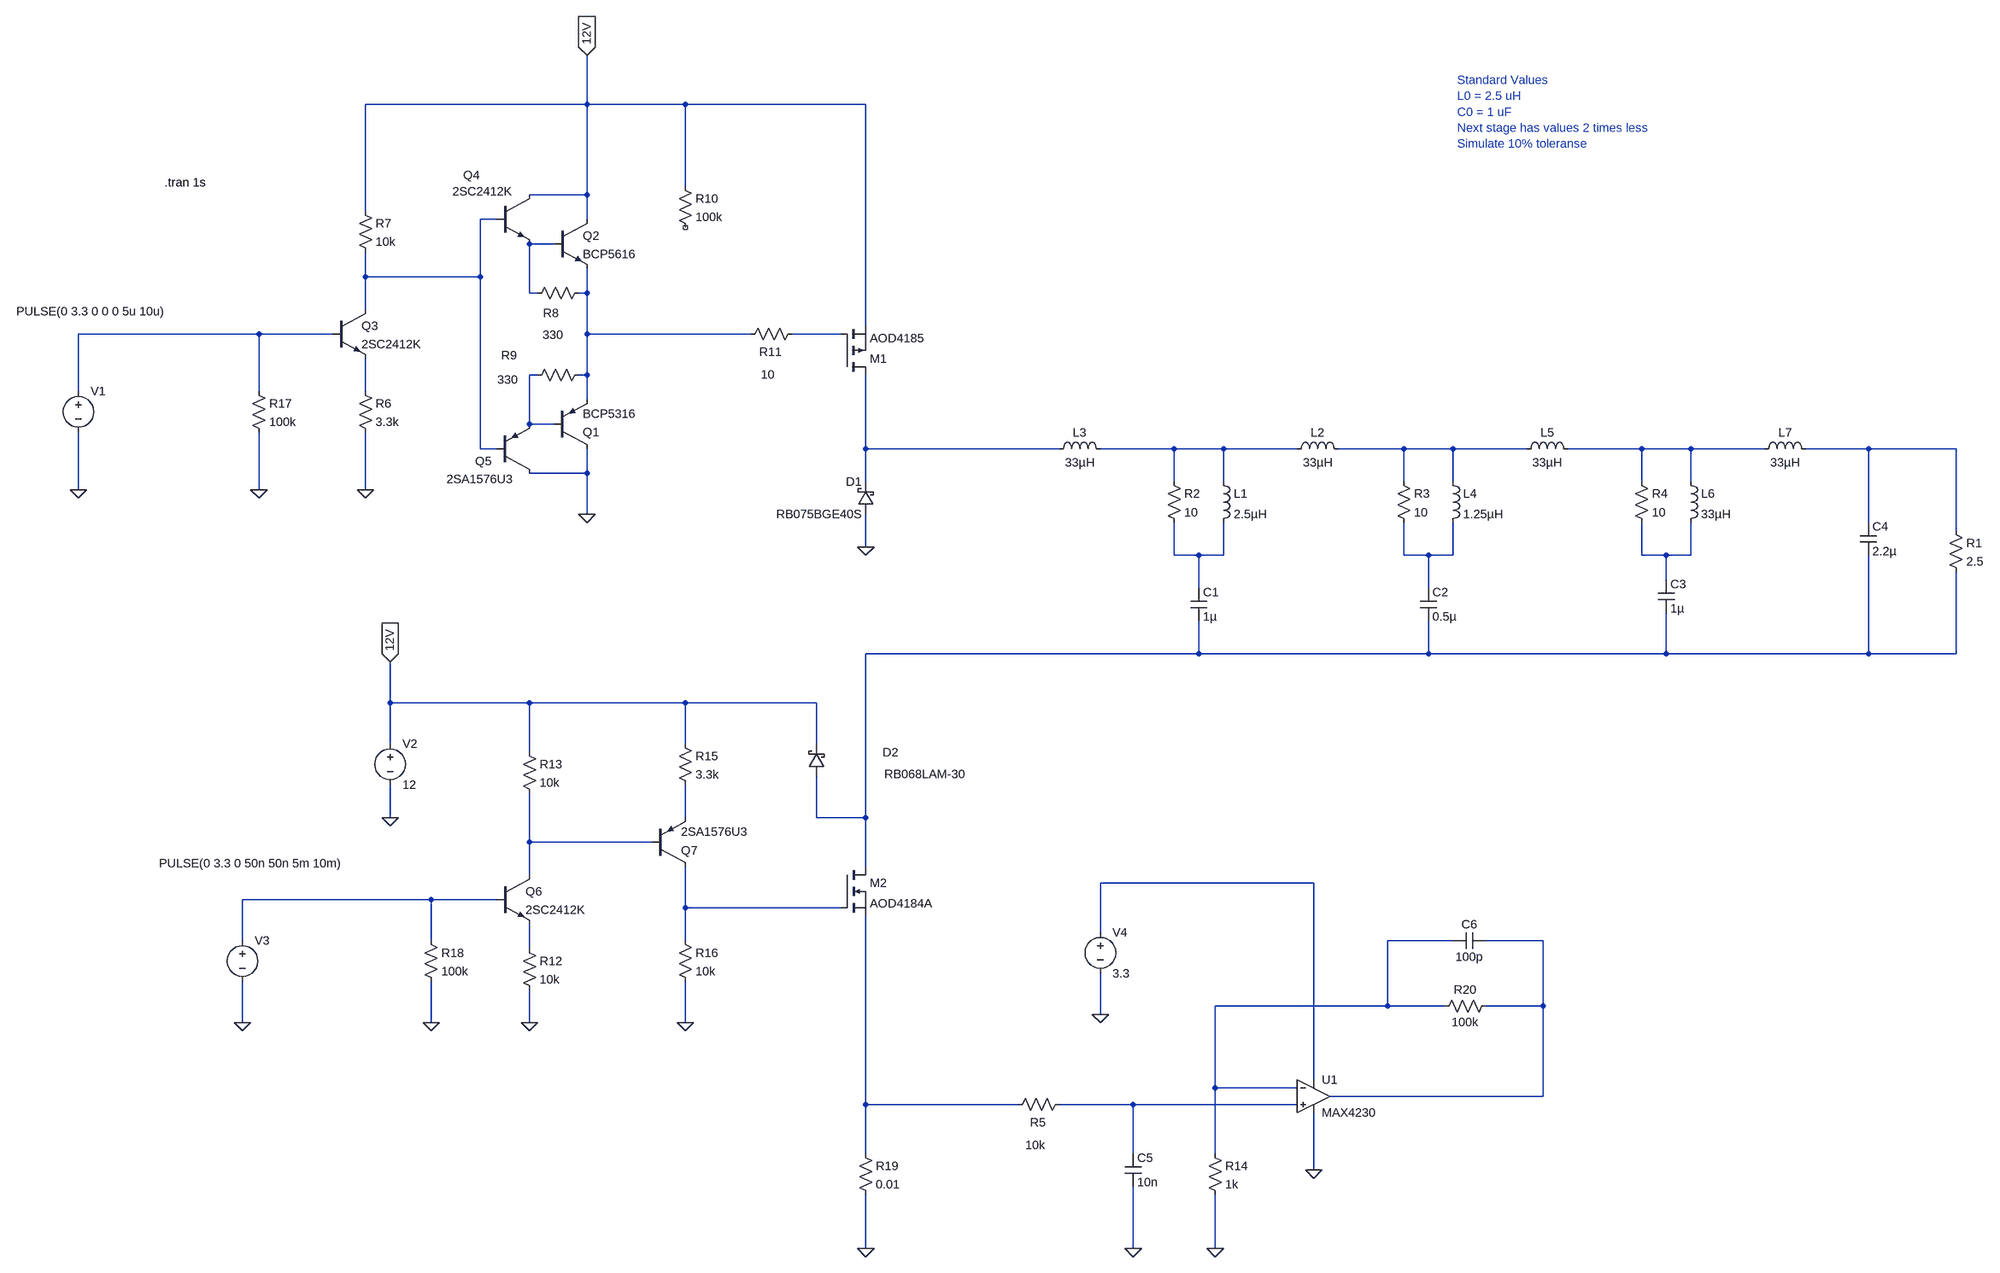
[diagram p0: schematic PWM_SW_one_wing_01.asc]
PWM_SW_one_wing_01.asc, the LTspice schematic file:
Version 4
SHEET 1 2332 2260
WIRE -960 -112 -960 -208
WIRE -960 -112 -1392 -112
WIRE -768 -112 -960 -112
WIRE -416 -112 -768 -112
WIRE -768 48 -768 -112
WIRE -960 64 -960 -112
WIRE -960 64 -1072 64
WIRE -1392 96 -1392 -112
WIRE -1136 112 -1168 112
WIRE -960 112 -960 64
WIRE -1024 160 -1072 160
WIRE -1392 224 -1392 176
WIRE -1168 224 -1168 112
WIRE -1168 224 -1392 224
WIRE -1072 256 -1072 160
WIRE -1056 256 -1072 256
WIRE -960 256 -960 208
WIRE -960 256 -976 256
WIRE -1392 288 -1392 224
WIRE -416 320 -416 -112
WIRE -1600 336 -1952 336
WIRE -1456 336 -1600 336
WIRE -960 336 -960 256
WIRE -640 336 -960 336
WIRE -464 336 -560 336
WIRE -1056 416 -1072 416
WIRE -960 416 -960 336
WIRE -960 416 -976 416
WIRE -1952 448 -1952 336
WIRE -1600 448 -1600 336
WIRE -1392 448 -1392 384
WIRE -960 464 -960 416
WIRE -1072 512 -1072 416
WIRE -1024 512 -1072 512
WIRE -1168 560 -1168 224
WIRE -1136 560 -1168 560
WIRE -416 560 -416 416
WIRE 0 560 -416 560
WIRE 224 560 80 560
WIRE 320 560 224 560
WIRE 464 560 320 560
WIRE 672 560 544 560
WIRE 768 560 672 560
WIRE 912 560 768 560
WIRE 1136 560 992 560
WIRE 1232 560 1136 560
WIRE 1376 560 1232 560
WIRE 1600 560 1456 560
WIRE 2096 560 1600 560
WIRE -960 608 -960 560
WIRE -960 608 -1072 608
WIRE -416 624 -416 560
WIRE 224 624 224 560
WIRE 320 624 320 560
WIRE 672 624 672 560
WIRE 768 624 768 560
WIRE 1136 624 1136 560
WIRE 1232 624 1232 560
WIRE -1952 640 -1952 528
WIRE -1600 640 -1600 528
WIRE -1392 640 -1392 528
WIRE -960 688 -960 608
WIRE 1600 704 1600 560
WIRE 2096 720 2096 560
WIRE -416 752 -416 688
WIRE 224 768 224 704
WIRE 272 768 224 768
WIRE 320 768 320 704
WIRE 320 768 272 768
WIRE 672 768 672 704
WIRE 720 768 672 768
WIRE 768 768 768 704
WIRE 768 768 720 768
WIRE 1136 768 1136 704
WIRE 1184 768 1136 768
WIRE 1232 768 1232 704
WIRE 1232 768 1184 768
WIRE 1184 816 1184 768
WIRE 272 832 272 768
WIRE 720 832 720 768
WIRE 272 960 272 896
WIRE 272 960 -416 960
WIRE 720 960 720 896
WIRE 720 960 272 960
WIRE 1184 960 1184 880
WIRE 1184 960 720 960
WIRE 1600 960 1600 768
WIRE 1600 960 1184 960
WIRE 2096 960 2096 800
WIRE 2096 960 1600 960
WIRE -1344 1056 -1344 976
WIRE -1072 1056 -1344 1056
WIRE -768 1056 -1072 1056
WIRE -512 1056 -768 1056
WIRE -1344 1136 -1344 1056
WIRE -768 1136 -768 1056
WIRE -512 1136 -512 1056
WIRE -1072 1152 -1072 1056
WIRE -1344 1280 -1344 1216
WIRE -768 1280 -768 1216
WIRE -512 1280 -512 1200
WIRE -416 1280 -416 960
WIRE -416 1280 -512 1280
WIRE -1072 1328 -1072 1232
WIRE -832 1328 -1072 1328
WIRE -416 1376 -416 1280
WIRE -1072 1392 -1072 1328
WIRE 496 1408 80 1408
WIRE -1264 1440 -1632 1440
WIRE -1136 1440 -1264 1440
WIRE -768 1456 -768 1376
WIRE -464 1456 -768 1456
WIRE 80 1504 80 1408
WIRE -1632 1520 -1632 1440
WIRE -1264 1520 -1264 1440
WIRE -768 1520 -768 1456
WIRE 768 1520 640 1520
WIRE 944 1520 832 1520
WIRE -1072 1536 -1072 1488
WIRE 640 1648 640 1520
WIRE 640 1648 304 1648
WIRE 752 1648 640 1648
WIRE 944 1648 944 1520
WIRE 944 1648 832 1648
WIRE 80 1664 80 1584
WIRE -1632 1680 -1632 1600
WIRE -1264 1680 -1264 1600
WIRE -1072 1680 -1072 1616
WIRE -768 1680 -768 1600
WIRE 496 1792 496 1408
WIRE 304 1808 304 1648
WIRE 464 1808 304 1808
WIRE 944 1824 944 1648
WIRE 944 1824 528 1824
WIRE -416 1840 -416 1472
WIRE -80 1840 -416 1840
WIRE 144 1840 0 1840
WIRE 464 1840 144 1840
WIRE -416 1936 -416 1840
WIRE 144 1936 144 1840
WIRE 304 1936 304 1808
WIRE 496 1968 496 1856
WIRE -416 2128 -416 2016
WIRE 144 2128 144 2000
WIRE 304 2128 304 2016
FLAG -1952 640 0
FLAG -1344 1280 0
FLAG -960 -208 12V
IOPIN -960 -208 In
FLAG -1344 976 12V
IOPIN -1344 976 In
FLAG -1392 640 0
FLAG -960 688 0
FLAG -1072 1680 0
FLAG -1632 1680 0
FLAG -768 1680 0
FLAG -416 2128 0
FLAG -416 752 0
FLAG -1600 640 0
FLAG -1264 1680 0
FLAG 144 2128 0
FLAG 80 1664 0
FLAG 496 1968 0
FLAG 304 2128 0
SYMBOL voltage -1952 432 R0
WINDOW 123 0 0 Left 0
WINDOW 39 0 0 Left 0
WINDOW 3 -121 -140 Left 2
SYMATTR InstName V1
SYMATTR Value PULSE(0 3.3 0 0 0 5u 10u)
SYMBOL res 2080 704 R0
SYMATTR InstName R1
SYMATTR Value 2.5
SYMBOL cap 256 832 R0
SYMATTR InstName C1
SYMATTR Value 1µ
SYMBOL ind 304 608 R0
SYMATTR InstName L1
SYMATTR Value 2.5µH
SYMBOL ind 448 576 R270
WINDOW 0 32 56 VTop 2
WINDOW 3 5 56 VBottom 2
SYMATTR InstName L2
SYMATTR Value 33µH
SYMBOL ind -16 576 R270
WINDOW 0 32 56 VTop 2
WINDOW 3 5 56 VBottom 2
SYMATTR InstName L3
SYMATTR Value 33µH
SYMBOL cap 704 832 R0
SYMATTR InstName C2
SYMATTR Value 0.5µ
SYMBOL ind 752 608 R0
SYMATTR InstName L4
SYMATTR Value 1.25µH
SYMBOL ind 896 576 R270
WINDOW 0 32 56 VTop 2
WINDOW 3 5 56 VBottom 2
SYMATTR InstName L5
SYMATTR Value 33µH
SYMBOL cap 1168 816 R0
SYMATTR InstName C3
SYMATTR Value 1µ
SYMBOL ind 1216 608 R0
SYMATTR InstName L6
SYMATTR Value 33µH
SYMBOL res 208 608 R0
SYMATTR InstName R2
SYMATTR Value 10
SYMBOL res 656 608 R0
SYMATTR InstName R3
SYMATTR Value 10
SYMBOL res 1120 608 R0
SYMATTR InstName R4
SYMATTR Value 10
SYMBOL voltage -1344 1120 R0
WINDOW 123 0 0 Left 0
WINDOW 39 0 0 Left 0
SYMATTR InstName V2
SYMATTR Value 12
SYMBOL schottky -400 688 R180
WINDOW 0 24 64 Left 2
WINDOW 3 24 0 Left 2
SYMATTR InstName D1
SYMATTR Value RB075BGE40S
SYMATTR Description Diode
SYMATTR Type diode
SYMBOL pnp -1024 560 M180
SYMATTR InstName Q1
SYMATTR Value BCP5316
SYMBOL npn -1024 112 R0
SYMATTR InstName Q2
SYMATTR Value BCP5616
SYMBOL npn -1456 288 R0
SYMATTR InstName Q3
SYMATTR Value 2SC2412K
SYMBOL res -1408 432 R0
SYMATTR InstName R6
SYMATTR Value 3.3k
SYMBOL res -1408 80 R0
SYMATTR InstName R7
SYMATTR Value 10k
SYMBOL pmos -464 416 M180
SYMATTR InstName M1
SYMATTR Value AOD4185
SYMBOL res -960 240 R90
WINDOW 0 71 70 VBottom 2
WINDOW 3 82 66 VTop 2
SYMATTR InstName R8
SYMATTR Value 330
SYMBOL res -960 400 R90
WINDOW 0 -7 152 VBottom 2
WINDOW 3 10 154 VTop 2
SYMATTR InstName R9
SYMATTR Value 330
SYMBOL npn -1136 64 R0
WINDOW 0 -65 -38 Left 2
WINDOW 3 -86 -6 Left 2
SYMATTR InstName Q4
SYMATTR Value 2SC2412K
SYMBOL pnp -1136 608 M180
WINDOW 0 -42 24 Left 2
WINDOW 3 -98 -11 Left 2
SYMATTR InstName Q5
SYMATTR Value 2SA1576U3
SYMBOL res -784 32 R0
SYMATTR InstName R10
SYMATTR Value 100k
SYMBOL res -544 320 R90
WINDOW 0 67 58 VBottom 2
WINDOW 3 80 63 VTop 2
SYMATTR InstName R11
SYMATTR Value 10
SYMBOL cap 1584 704 R0
SYMATTR InstName C4
SYMATTR Value 2.2µ
SYMBOL ind 1360 576 R270
WINDOW 0 32 56 VTop 2
WINDOW 3 5 56 VBottom 2
SYMATTR InstName L7
SYMATTR Value 33µH
SYMBOL npn -1136 1392 R0
SYMATTR InstName Q6
SYMATTR Value 2SC2412K
SYMBOL res -1088 1520 R0
SYMATTR InstName R12
SYMATTR Value 10k
SYMBOL res -1088 1136 R0
SYMATTR InstName R13
SYMATTR Value 10k
SYMBOL voltage -1632 1504 R0
WINDOW 123 0 0 Left 0
WINDOW 39 0 0 Left 0
WINDOW 3 -163 -135 Left 2
SYMATTR InstName V3
SYMATTR Value PULSE(0 3.3 0 50n 50n 5m 10m)
SYMBOL pnp -832 1376 M180
SYMATTR InstName Q7
SYMATTR Value 2SA1576U3
SYMBOL res -784 1120 R0
SYMATTR InstName R15
SYMATTR Value 3.3k
SYMBOL res -784 1504 R0
SYMATTR InstName R16
SYMATTR Value 10k
SYMBOL nmos -464 1376 R0
SYMATTR InstName M2
SYMATTR Value AOD4184A
SYMBOL res -1616 432 R0
SYMATTR InstName R17
SYMATTR Value 100k
SYMBOL res -1280 1504 R0
SYMATTR InstName R18
SYMATTR Value 100k
SYMBOL res -432 1920 R0
SYMATTR InstName R19
SYMATTR Value 0.01
SYMBOL OpAmps\\MAX4230 496 1760 R0
SYMATTR InstName U1
SYMBOL res 16 1824 R90
WINDOW 0 67 58 VBottom 2
WINDOW 3 80 63 VTop 2
SYMATTR InstName R5
SYMATTR Value 10k
SYMBOL cap 128 1936 R0
SYMATTR InstName C5
SYMATTR Value 10n
SYMBOL res 288 1920 R0
SYMATTR InstName R14
SYMATTR Value 1k
SYMBOL res 848 1632 R90
WINDOW 0 0 56 VBottom 2
WINDOW 3 32 56 VTop 2
SYMATTR InstName R20
SYMATTR Value 100k
SYMBOL voltage 80 1488 R0
WINDOW 123 0 0 Left 0
WINDOW 39 0 0 Left 0
SYMATTR InstName V4
SYMATTR Value 3.3
SYMBOL cap 832 1504 R90
WINDOW 0 0 32 VBottom 2
WINDOW 3 32 32 VTop 2
SYMATTR InstName C6
SYMATTR Value 100p
SYMBOL schottky -496 1200 R180
WINDOW 0 -144 47 Left 2
WINDOW 3 -275 5 Left 2
SYMATTR InstName D2
SYMATTR Value RB068LAM-30
SYMATTR Description Diode
SYMATTR Type diode
TEXT -1784 40 Left 2 !.tran 1s
TEXT 776 -160 Left 2 ;Standard Values\nL0 = 2.5 uH\nC0 = 1 uF\nNext stage has values 2 times less\nSimulate 10% toleranse

The netlist it stands for:
* PWM_SW_one_wing_01.asc
V1 N004 0 PULSE(0 3.3 0 0 0 5u 10u)
R1 N012 N016 2.5
C1 N013 N016 1µ
L1 N009 N013 2.5µH
L2 N009 N010 33µH
L3 N008 N009 33µH
C2 N014 N016 0.5µ
L4 N010 N014 1.25µH
L5 N010 N011 33µH
C3 N015 N016 1µ
L6 N011 N015 33µH
R2 N009 N013 10
R3 N010 N014 10
R4 N011 N015 10
V2 12V 0 12
D1 0 N008 RB075BGE40S
Q1 0 N006 N003 0 BCP5316
Q2 12V N002 N003 0 BCP5616
Q3 N001 N004 N007 0 2SC2412K
R6 N007 0 3.3k
R7 12V N001 10k
M1 N008 N005 12V 12V AOD4185
R8 N003 N002 330
R9 N003 N006 330
Q4 12V N001 N002 0 2SC2412K
Q5 0 N001 N006 0 2SA1576U3
R10 12V NC_01 100k
R11 N005 N003 10
C4 N012 N016 2.2µ
L7 N011 N012 33µH
Q6 N018 N020 N024 0 2SC2412K
R12 N024 0 10k
R13 12V N018 10k
V3 N020 0 PULSE(0 3.3 0 50n 50n 5m 10m)
Q7 N021 N018 N017 0 2SA1576U3
R15 12V N017 3.3k
R16 N021 0 10k
M2 N016 N021 N025 N025 AOD4184A
R17 N004 0 100k
R18 N020 0 100k
R19 N025 0 0.01
XU1 N026 N022 N019 0 N023 MAX4230  ; pins In+ In- V+ V- OUT
R5 N026 N025 10k
C5 N026 0 10n
R14 N022 0 1k
R20 N023 N022 100k
V4 N019 0 3.3
C6 N023 N022 100p
D2 N016 12V RB068LAM-30
.model D D
.lib standard.dio
.model NPN NPN
.model PNP PNP
.lib standard.bjt
.model NMOS NMOS
.model PMOS PMOS
.lib standard.mos
.tran 1s
* Standard Values
* L0 = 2.5 uH
* C0 = 1 uF
* Next stage has values 2 times less
* Simulate 10% toleranse
.lib MAX4230.lib
.backanno
.end